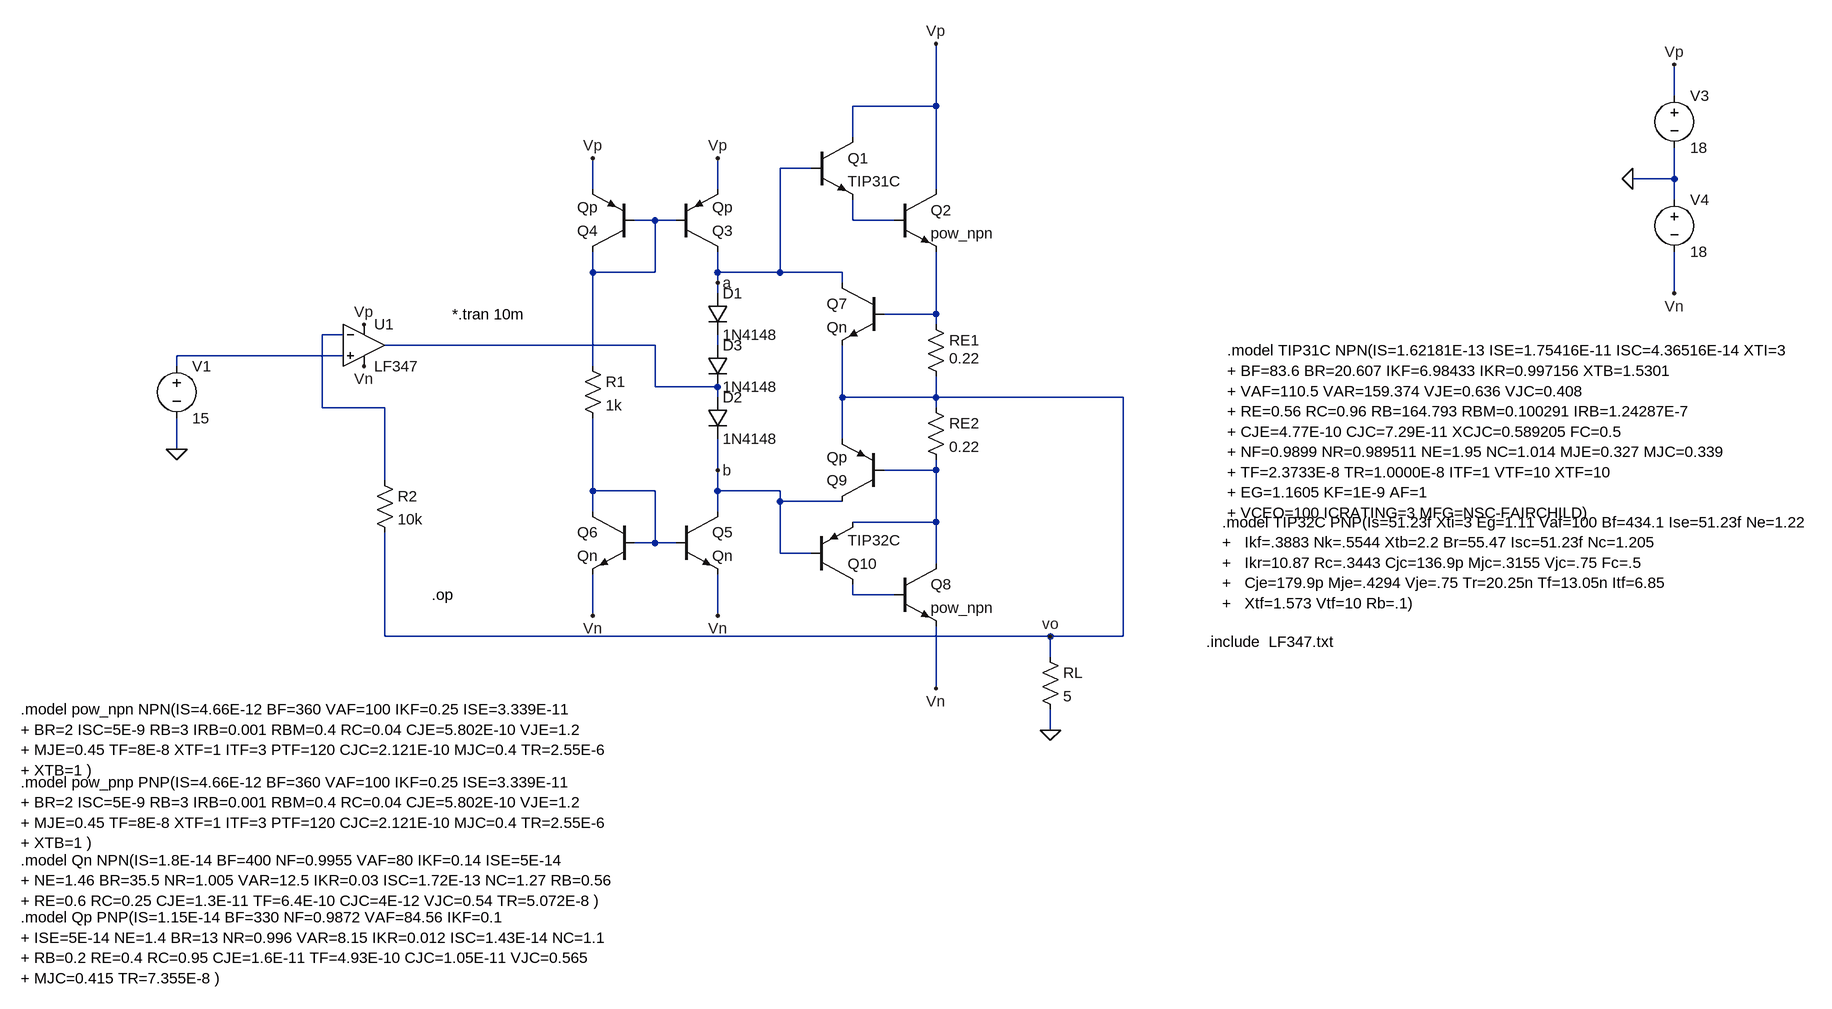
[diagram p0: schematic PA_stage.asc]
PA_stage.asc, the LTspice schematic file:
Version 4.1
SHEET 1 2048 1176
WIRE 1744 -208 1744 -256
WIRE 608 -192 608 -288
WIRE 608 -192 480 -192
WIRE 480 -144 480 -192
WIRE 416 -96 368 -96
WIRE 1744 -80 1744 -128
WIRE 1744 -80 1680 -80
WIRE 80 -64 80 -112
WIRE 272 -64 272 -112
WIRE 608 -64 608 -192
WIRE 1744 -48 1744 -80
WIRE 176 -16 144 -16
WIRE 208 -16 176 -16
WIRE 480 -16 480 -48
WIRE 544 -16 480 -16
WIRE 80 64 80 32
WIRE 176 64 176 -16
WIRE 176 64 80 64
WIRE 272 64 272 32
WIRE 368 64 368 -96
WIRE 368 64 272 64
WIRE 464 64 368 64
WIRE 272 80 272 64
WIRE 464 80 464 64
WIRE 272 96 272 80
WIRE 1744 96 1744 32
WIRE 608 128 608 32
WIRE 608 128 528 128
WIRE 608 144 608 128
WIRE -304 160 -336 160
WIRE 176 176 -240 176
WIRE 272 176 272 160
WIRE -304 192 -560 192
WIRE -560 208 -560 192
WIRE 80 208 80 64
WIRE 176 240 176 176
WIRE 272 240 176 240
WIRE 272 256 272 240
WIRE 464 256 464 176
WIRE 608 256 608 224
WIRE 608 256 464 256
WIRE 896 256 608 256
WIRE -336 272 -336 160
WIRE -240 272 -336 272
WIRE 608 272 608 256
WIRE 464 320 464 256
WIRE -560 336 -560 288
WIRE 272 368 272 320
WIRE 608 368 608 352
WIRE 608 368 528 368
WIRE -240 384 -240 272
WIRE 80 400 80 288
WIRE 176 400 80 400
WIRE 272 400 272 368
WIRE 368 400 272 400
WIRE 368 416 368 400
WIRE 464 416 368 416
WIRE 80 432 80 400
WIRE 272 432 272 400
WIRE 608 448 608 368
WIRE 608 448 480 448
WIRE 176 480 176 400
WIRE 176 480 144 480
WIRE 208 480 176 480
WIRE 368 496 368 416
WIRE 416 496 368 496
WIRE 608 512 608 448
WIRE 480 560 480 544
WIRE 544 560 480 560
WIRE 80 592 80 528
WIRE 272 592 272 528
WIRE -240 624 -240 464
WIRE 784 624 -240 624
WIRE 896 624 896 256
WIRE 896 624 784 624
WIRE 784 656 784 624
WIRE 608 704 608 608
WIRE 784 768 784 736
FLAG 1744 96 Vn
FLAG 1744 -256 Vp
FLAG 1680 -80 0
FLAG 608 -288 Vp
FLAG 272 -112 Vp
FLAG 272 592 Vn
FLAG 784 768 0
FLAG 272 80 a
FLAG 272 368 b
FLAG 784 624 vo
FLAG 80 592 Vn
FLAG 80 -112 Vp
FLAG -272 208 Vn
FLAG -272 144 Vp
FLAG -560 336 0
FLAG 608 704 Vn
SYMBOL res 592 128 R0
WINDOW 3 36 68 Left 2
SYMATTR Value 0.22
SYMATTR InstName RE1
SYMBOL res 592 256 R0
SYMATTR InstName RE2
SYMATTR Value 0.22
SYMBOL voltage 1744 -224 R0
WINDOW 123 0 0 Left 0
WINDOW 39 0 0 Left 0
SYMATTR InstName V3
SYMATTR Value 18
SYMBOL voltage 1744 -64 R0
WINDOW 123 0 0 Left 0
WINDOW 39 0 0 Left 0
SYMATTR InstName V4
SYMATTR Value 18
SYMBOL res 768 640 R0
SYMATTR InstName RL
SYMATTR Value 5
SYMBOL pnp 208 32 M180
SYMATTR InstName Q3
SYMATTR Value Qp
SYMBOL pnp 144 32 R180
SYMATTR InstName Q4
SYMATTR Value Qp
SYMBOL npn 208 432 R0
SYMATTR InstName Q5
SYMATTR Value Qn
SYMBOL npn 144 432 M0
SYMATTR InstName Q6
SYMATTR Value Qn
SYMBOL res 64 192 R0
SYMATTR InstName R1
SYMATTR Value 1k
SYMBOL diode 256 256 R0
SYMATTR InstName D2
SYMATTR Value 1N4148
SYMBOL npn 416 -144 R0
SYMATTR InstName Q1
SYMATTR Value TIP31C
SYMBOL npn 544 -64 R0
SYMATTR InstName Q2
SYMATTR Value pow_npn
SYMBOL npn 544 512 R0
SYMATTR InstName Q8
SYMATTR Value pow_npn
SYMBOL diode 256 96 R0
SYMATTR InstName D1
SYMATTR Value 1N4148
SYMBOL diode 256 176 R0
SYMATTR InstName D3
SYMATTR Value 1N4148
SYMBOL res -256 368 R0
SYMATTR InstName R2
SYMATTR Value 10k
SYMBOL npn 528 80 M0
SYMATTR InstName Q7
SYMATTR Value Qn
SYMBOL pnp 528 416 R180
SYMATTR InstName Q9
SYMATTR Value Qp
SYMBOL pnp 416 544 M180
SYMATTR InstName Q10
SYMATTR Value TIP32C
SYMBOL OpAmps\\opamp2 -272 112 R0
SYMATTR InstName U1
SYMATTR Value LF347
SYMBOL voltage -560 192 R0
WINDOW 123 0 0 Left 0
WINDOW 39 0 0 Left 0
SYMATTR InstName V1
SYMATTR Value 15
TEXT -800 736 Left 2 !.model pow_npn NPN(IS=4.66E-12 BF=360 VAF=100 IKF=0.25 ISE=3.339E-11 \n+ BR=2 ISC=5E-9 RB=3 IRB=0.001 RBM=0.4 RC=0.04 CJE=5.802E-10 VJE=1.2 \n+ MJE=0.45 TF=8E-8 XTF=1 ITF=3 PTF=120 CJC=2.121E-10 MJC=0.4 TR=2.55E-6 \n+ XTB=1 )
TEXT -800 848 Left 2 !.model pow_pnp PNP(IS=4.66E-12 BF=360 VAF=100 IKF=0.25 ISE=3.339E-11 \n+ BR=2 ISC=5E-9 RB=3 IRB=0.001 RBM=0.4 RC=0.04 CJE=5.802E-10 VJE=1.2 \n+ MJE=0.45 TF=8E-8 XTF=1 ITF=3 PTF=120 CJC=2.121E-10 MJC=0.4 TR=2.55E-6 \n+ XTB=1 )
TEXT -800 968 Left 2 !.model Qn NPN(IS=1.8E-14 BF=400 NF=0.9955 VAF=80 IKF=0.14 ISE=5E-14 \n+ NE=1.46 BR=35.5 NR=1.005 VAR=12.5 IKR=0.03 ISC=1.72E-13 NC=1.27 RB=0.56 \n+ RE=0.6 RC=0.25 CJE=1.3E-11 TF=6.4E-10 CJC=4E-12 VJC=0.54 TR=5.072E-8 )
TEXT -800 1056 Left 2 !.model Qp PNP(IS=1.15E-14 BF=330 NF=0.9872 VAF=84.56 IKF=0.1 \n+ ISE=5E-14 NE=1.4 BR=13 NR=0.996 VAR=8.15 IKR=0.012 ISC=1.43E-14 NC=1.1 \n+ RB=0.2 RE=0.4 RC=0.95 CJE=1.6E-11 TF=4.93E-10 CJC=1.05E-11 VJC=0.565 \n+ MJC=0.415 TR=7.355E-8 )
TEXT 1056 184 Left 2 !.model TIP31C NPN(IS=1.62181E-13 ISE=1.75416E-11 ISC=4.36516E-14 XTI=3\n+ BF=83.6 BR=20.607 IKF=6.98433 IKR=0.997156 XTB=1.5301\n+ VAF=110.5 VAR=159.374 VJE=0.636 VJC=0.408\n+ RE=0.56 RC=0.96 RB=164.793 RBM=0.100291 IRB=1.24287E-7\n+ CJE=4.77E-10 CJC=7.29E-11 XCJC=0.589205 FC=0.5\n+ NF=0.9899 NR=0.989511 NE=1.95 NC=1.014 MJE=0.327 MJC=0.339\n+ TF=2.3733E-8 TR=1.0000E-8 ITF=1 VTF=10 XTF=10\n+ EG=1.1605 KF=1E-9 AF=1\n+ VCEO=100 ICRATING=3 MFG=NSC-FAIRCHILD)
TEXT 1048 448 Left 2 !.model TIP32C PNP(Is=51.23f Xti=3 Eg=1.11 Vaf=100 Bf=434.1 Ise=51.23f Ne=1.22\n+   Ikf=.3883 Nk=.5544 Xtb=2.2 Br=55.47 Isc=51.23f Nc=1.205\n+   Ikr=10.87 Rc=.3443 Cjc=136.9p Mjc=.3155 Vjc=.75 Fc=.5\n+   Cje=179.9p Mje=.4294 Vje=.75 Tr=20.25n Tf=13.05n Itf=6.85\n+   Xtf=1.573 Vtf=10 Rb=.1)
TEXT 1024 632 Left 2 !.include  LF347.txt
TEXT -136 128 Left 2 !*.tran 10m
TEXT -168 560 Left 2 !.op

The netlist it stands for:
* PA_stage.asc
RE1 N003 vo 0.22
RE2 vo N008 0.22
V3 Vp 0 18
V4 0 Vn 18
RL vo 0 5
Q3 a N001 Vp 0 Qp
Q4 N001 N001 Vp 0 Qp
Q5 b N009 Vn 0 Qn
Q6 N009 N009 Vn 0 Qn
R1 N001 N009 1k
D2 N005 b 1N4148
Q1 Vp a N002 0 TIP31C
Q2 Vp N002 N003 0 pow_npn
Q8 N008 N010 Vn 0 pow_npn
D1 a N006 1N4148
D3 N006 N005 1N4148
R2 N004 vo 10k
Q7 a N003 vo 0 Qn
Q9 b N008 vo 0 Qp
Q10 N010 b N008 0 TIP32C
X§U1 N007 N004 Vp Vn N005 LF347  ; pins In+ In- V+ V- OUT
V1 N007 0 15
.model D D
.lib standard.dio
.model NPN NPN
.model PNP PNP
.lib standard.bjt
.model pow_npn NPN(IS=4.66E-12 BF=360 VAF=100 IKF=0.25 ISE=3.339E-11
+ BR=2 ISC=5E-9 RB=3 IRB=0.001 RBM=0.4 RC=0.04 CJE=5.802E-10 VJE=1.2
+ MJE=0.45 TF=8E-8 XTF=1 ITF=3 PTF=120 CJC=2.121E-10 MJC=0.4 TR=2.55E-6
+ XTB=1 )
.model pow_pnp PNP(IS=4.66E-12 BF=360 VAF=100 IKF=0.25 ISE=3.339E-11
+ BR=2 ISC=5E-9 RB=3 IRB=0.001 RBM=0.4 RC=0.04 CJE=5.802E-10 VJE=1.2
+ MJE=0.45 TF=8E-8 XTF=1 ITF=3 PTF=120 CJC=2.121E-10 MJC=0.4 TR=2.55E-6
+ XTB=1 )
.model Qn NPN(IS=1.8E-14 BF=400 NF=0.9955 VAF=80 IKF=0.14 ISE=5E-14
+ NE=1.46 BR=35.5 NR=1.005 VAR=12.5 IKR=0.03 ISC=1.72E-13 NC=1.27 RB=0.56
+ RE=0.6 RC=0.25 CJE=1.3E-11 TF=6.4E-10 CJC=4E-12 VJC=0.54 TR=5.072E-8 )
.model Qp PNP(IS=1.15E-14 BF=330 NF=0.9872 VAF=84.56 IKF=0.1
+ ISE=5E-14 NE=1.4 BR=13 NR=0.996 VAR=8.15 IKR=0.012 ISC=1.43E-14 NC=1.1
+ RB=0.2 RE=0.4 RC=0.95 CJE=1.6E-11 TF=4.93E-10 CJC=1.05E-11 VJC=0.565
+ MJC=0.415 TR=7.355E-8 )
.model TIP31C NPN(IS=1.62181E-13 ISE=1.75416E-11 ISC=4.36516E-14 XTI=3
+ BF=83.6 BR=20.607 IKF=6.98433 IKR=0.997156 XTB=1.5301
+ VAF=110.5 VAR=159.374 VJE=0.636 VJC=0.408
+ RE=0.56 RC=0.96 RB=164.793 RBM=0.100291 IRB=1.24287E-7
+ CJE=4.77E-10 CJC=7.29E-11 XCJC=0.589205 FC=0.5
+ NF=0.9899 NR=0.989511 NE=1.95 NC=1.014 MJE=0.327 MJC=0.339
+ TF=2.3733E-8 TR=1.0000E-8 ITF=1 VTF=10 XTF=10
+ EG=1.1605 KF=1E-9 AF=1
+ VCEO=100 ICRATING=3 MFG=NSC-FAIRCHILD)
.model TIP32C PNP(Is=51.23f Xti=3 Eg=1.11 Vaf=100 Bf=434.1 Ise=51.23f Ne=1.22
+   Ikf=.3883 Nk=.5544 Xtb=2.2 Br=55.47 Isc=51.23f Nc=1.205
+   Ikr=10.87 Rc=.3443 Cjc=136.9p Mjc=.3155 Vjc=.75 Fc=.5
+   Cje=179.9p Mje=.4294 Vje=.75 Tr=20.25n Tf=13.05n Itf=6.85
+   Xtf=1.573 Vtf=10 Rb=.1)
.include  LF347.txt
*.tran 10m
.op
.backanno
.end